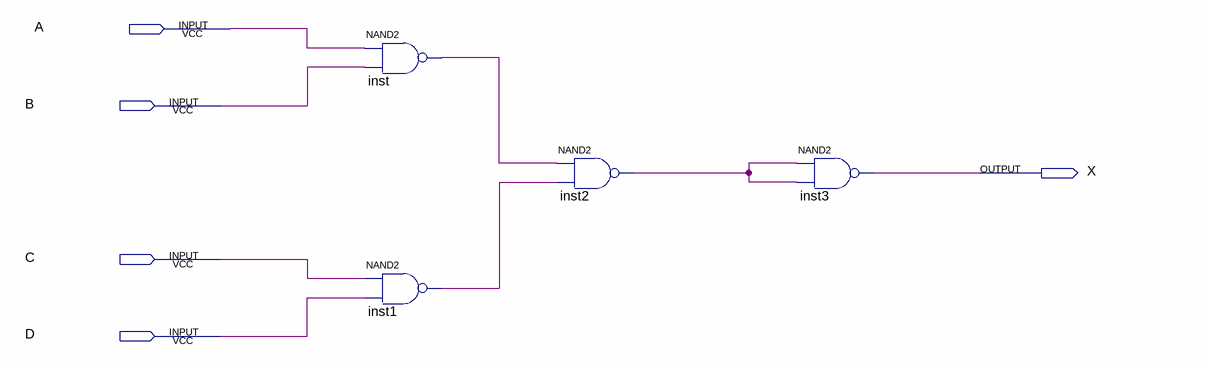
[diagram p0: schematic sheet]
// Quartus schematic nand_logic2.bdf as structural Verilog: 4 symbols, 5 pins
module nand_logic2 (
  input  A,
  input  B,
  input  C,
  input  D,
  output X
);

  wire inst1_out, inst2_out, inst_out;

  nand inst (inst_out, A, B);
  nand inst1 (inst1_out, C, D);
  nand inst2 (inst2_out, inst_out, inst1_out);
  nand inst3 (X, inst2_out, inst2_out);
endmodule
